# EAGLE design de1_breakout (EAGLE 6.5.0)
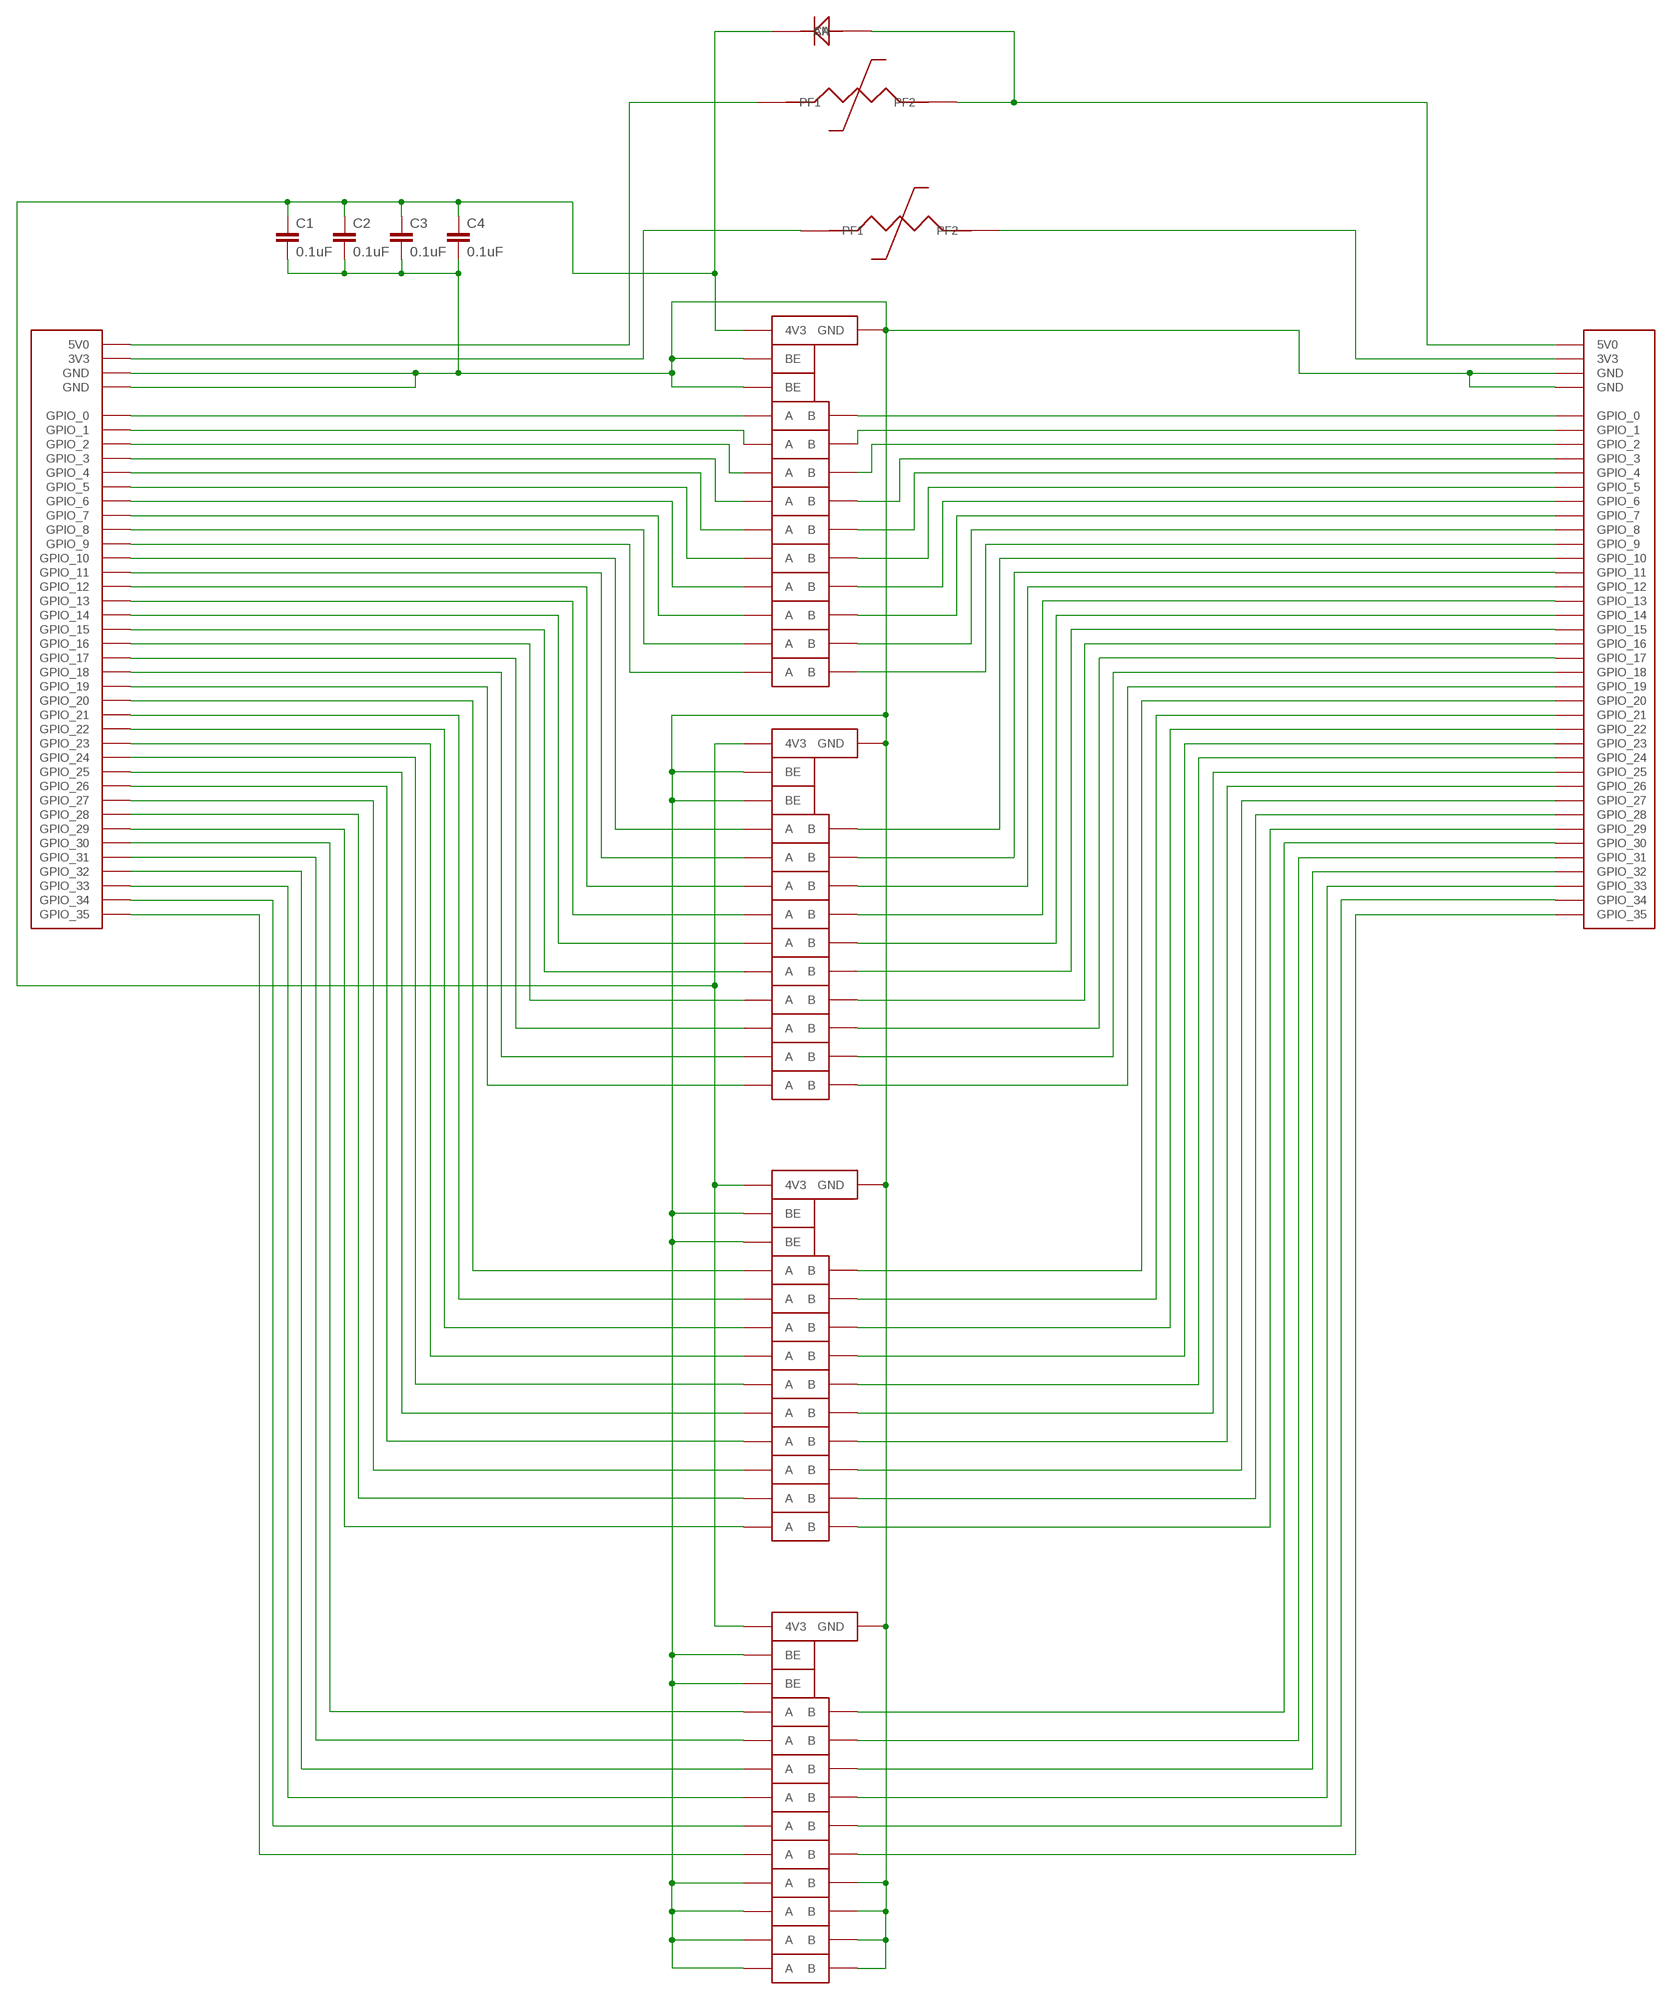
[diagram p0: schematic, sheet 1]

## Parts
1N4148  1N4148  [SOD123]
3VPOLY  POLYFUSE_1206  [C1206]
5VPOLY  POLYFUSE_1206  [C1206]
C1  0.1uF  C-EUC1206  [C1206]
C2  0.1uF  C-EUC1206  [C1206]
C3  0.1uF  C-EUC1206  [C1206]
C4  0.1uF  C-EUC1206  [C1206]
DE1_GPIO  DE1_GPIO  [DIL-100-2X20]
EXT_GPIO  DE1_GPIO_L  [DIL-100-2X20]
IC1  QS3384  [TSSOP24]
IC2  QS3384  [TSSOP24]
IC3  QS3384  [TSSOP24]
IC4  QS3384  [TSSOP24]

## Nets
3V3_IN: 3VPOLY.1(PF1) DE1_GPIO.29(3V3)
3V3_OUT: 3VPOLY.2(PF2) EXT_GPIO.29(3V3)
4V3_INT: 1N4148.1(CA) C1.1 C2.1 C3.1 C4.1 IC1.24(4V3) IC2.24(4V3) IC3.24(4V3) IC4.24(4V3)
5V0_IN: 5VPOLY.1(PF1) DE1_GPIO.11(5V0)
5V0_OUT: 1N4148.2(AN) 5VPOLY.2(PF2) EXT_GPIO.11(5V0)
GND: C1.2 C2.2 C3.2 C4.2 DE1_GPIO.12(GND) DE1_GPIO.30(GND) EXT_GPIO.12(GND) EXT_GPIO.30(GND) IC1.1(BEA:BE) IC1.12(GND) IC1.13(BEB:BE) IC2.1(BEA:BE) IC2.12(GND) IC2.13(BEB:BE) IC3.1(BEA:BE) IC3.12(GND) IC3.13(BEB:BE) IC4.1(BEA:BE) IC4.12(GND) IC4.13(BEB:BE) IC4.16(B) IC4.17(A) IC4.18(A) IC4.19(B) IC4.20(B) IC4.21(A) IC4.22(A) IC4.23(B)
N$2: DE1_GPIO.1(GPIO_0) IC1.3(A)
N$3: DE1_GPIO.2(GPIO_1) IC1.4(A)
N$4: DE1_GPIO.3(GPIO_2) IC1.7(A)
N$5: DE1_GPIO.4(GPIO_3) IC1.8(A)
N$6: DE1_GPIO.5(GPIO_4) IC1.11(A)
N$7: DE1_GPIO.6(GPIO_5) IC1.14(A)
N$8: DE1_GPIO.7(GPIO_6) IC1.17(A)
N$9: DE1_GPIO.8(GPIO_7) IC1.18(A)
N$10: DE1_GPIO.9(GPIO_8) IC1.21(A)
N$11: DE1_GPIO.10(GPIO_9) IC1.22(A)
N$12: DE1_GPIO.13(GPIO_10) IC2.3(A)
N$13: DE1_GPIO.14(GPIO_11) IC2.4(A)
N$14: DE1_GPIO.15(GPIO_12) IC2.7(A)
N$15: DE1_GPIO.16(GPIO_13) IC2.8(A)
N$16: DE1_GPIO.17(GPIO_14) IC2.11(A)
N$17: DE1_GPIO.18(GPIO_15) IC2.14(A)
N$18: DE1_GPIO.19(GPIO_16) IC2.17(A)
N$19: DE1_GPIO.20(GPIO_17) IC2.18(A)
N$20: DE1_GPIO.21(GPIO_18) IC2.21(A)
N$21: DE1_GPIO.22(GPIO_19) IC2.22(A)
N$22: DE1_GPIO.23(GPIO_20) IC3.3(A)
N$23: DE1_GPIO.24(GPIO_21) IC3.4(A)
N$24: DE1_GPIO.25(GPIO_22) IC3.7(A)
N$25: DE1_GPIO.26(GPIO_23) IC3.8(A)
N$26: DE1_GPIO.27(GPIO_24) IC3.11(A)
N$27: DE1_GPIO.28(GPIO_25) IC3.14(A)
N$28: DE1_GPIO.31(GPIO_26) IC3.17(A)
N$29: DE1_GPIO.32(GPIO_27) IC3.18(A)
N$30: DE1_GPIO.33(GPIO_28) IC3.21(A)
N$31: DE1_GPIO.34(GPIO_29) IC3.22(A)
N$32: DE1_GPIO.37(GPIO_32) IC4.7(A)
N$33: DE1_GPIO.35(GPIO_30) IC4.3(A)
N$34: DE1_GPIO.36(GPIO_31) IC4.4(A)
N$35: DE1_GPIO.38(GPIO_33) IC4.8(A)
N$36: DE1_GPIO.39(GPIO_34) IC4.11(A)
N$37: DE1_GPIO.40(GPIO_35) IC4.14(A)
N$38: EXT_GPIO.1(GPIO_0) IC1.2(B)
N$39: EXT_GPIO.2(GPIO_1) IC1.5(B)
N$40: EXT_GPIO.3(GPIO_2) IC1.6(B)
N$41: EXT_GPIO.4(GPIO_3) IC1.9(B)
N$42: EXT_GPIO.5(GPIO_4) IC1.10(B)
N$43: EXT_GPIO.6(GPIO_5) IC1.15(B)
N$44: EXT_GPIO.7(GPIO_6) IC1.16(B)
N$45: EXT_GPIO.8(GPIO_7) IC1.19(B)
N$46: EXT_GPIO.9(GPIO_8) IC1.20(B)
N$47: EXT_GPIO.10(GPIO_9) IC1.23(B)
N$48: EXT_GPIO.14(GPIO_11) IC2.5(B)
N$49: EXT_GPIO.15(GPIO_12) IC2.6(B)
N$50: EXT_GPIO.13(GPIO_10) IC2.2(B)
N$51: EXT_GPIO.16(GPIO_13) IC2.9(B)
N$52: EXT_GPIO.17(GPIO_14) IC2.10(B)
N$53: EXT_GPIO.18(GPIO_15) IC2.15(B)
N$54: EXT_GPIO.19(GPIO_16) IC2.16(B)
N$55: EXT_GPIO.20(GPIO_17) IC2.19(B)
N$56: EXT_GPIO.24(GPIO_21) IC3.5(B)
N$57: EXT_GPIO.21(GPIO_18) IC2.20(B)
N$58: EXT_GPIO.22(GPIO_19) IC2.23(B)
N$59: EXT_GPIO.23(GPIO_20) IC3.2(B)
N$60: EXT_GPIO.25(GPIO_22) IC3.6(B)
N$61: EXT_GPIO.26(GPIO_23) IC3.9(B)
N$62: EXT_GPIO.27(GPIO_24) IC3.10(B)
N$63: EXT_GPIO.28(GPIO_25) IC3.15(B)
N$64: EXT_GPIO.31(GPIO_26) IC3.16(B)
N$65: EXT_GPIO.32(GPIO_27) IC3.19(B)
N$66: EXT_GPIO.33(GPIO_28) IC3.20(B)
N$67: EXT_GPIO.34(GPIO_29) IC3.23(B)
N$68: EXT_GPIO.35(GPIO_30) IC4.2(B)
N$69: EXT_GPIO.36(GPIO_31) IC4.5(B)
N$70: EXT_GPIO.37(GPIO_32) IC4.6(B)
N$71: EXT_GPIO.38(GPIO_33) IC4.9(B)
N$72: EXT_GPIO.39(GPIO_34) IC4.10(B)
N$73: EXT_GPIO.40(GPIO_35) IC4.15(B)

## Library data of the parts
1N4148 = quickswitch:1N4148
3VPOLY 5VPOLY = quickswitch:POLYFUSE_1206
C1-C4 = rcl:C-EU: CAPACITOR, European symbol
DE1_GPIO = quickswitch:DE1_GPIO
EXT_GPIO = quickswitch:DE1_GPIO_L
IC1-IC4 = quickswitch:QS3384: IDT Quickswitch - 3.3V/5V conversion

## Board
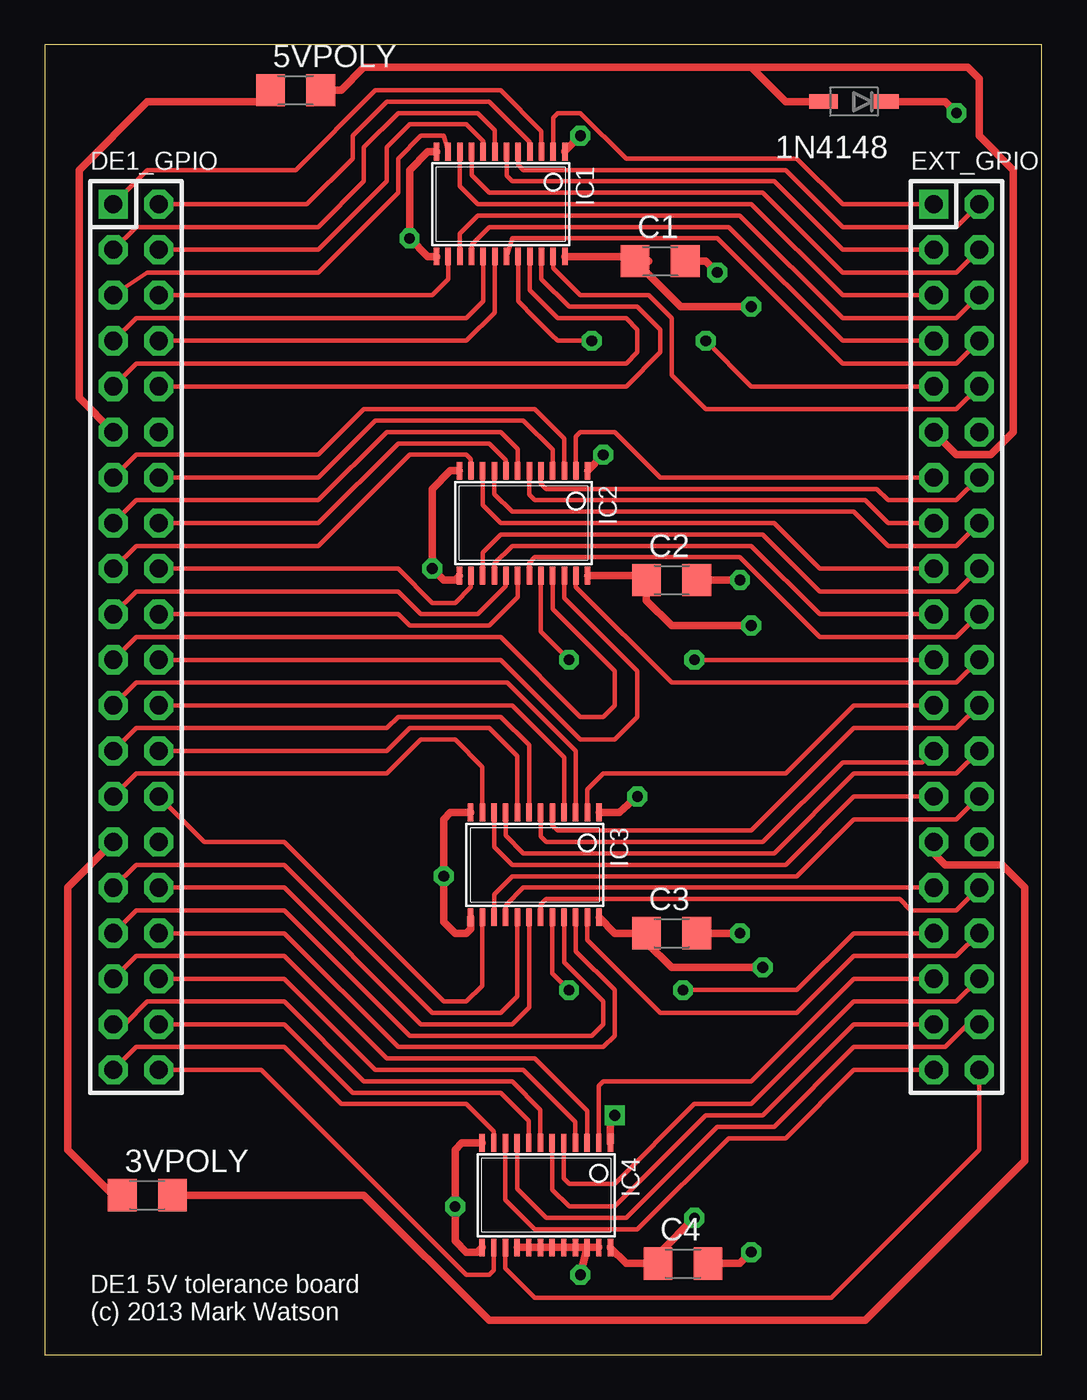
[diagram p1: board, top side]
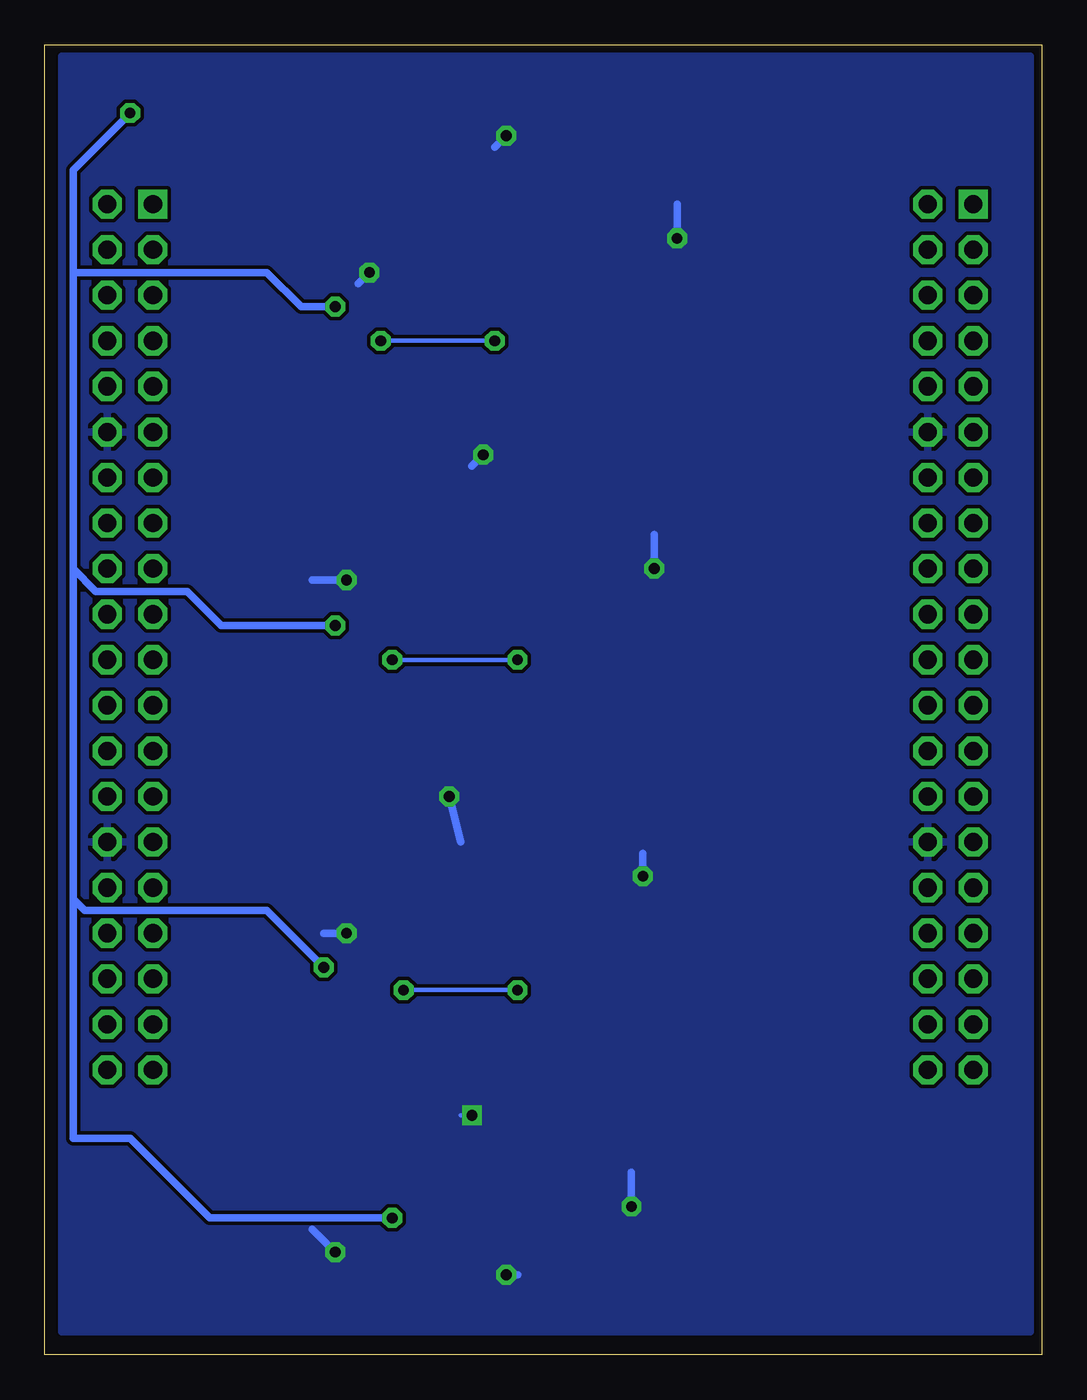
[diagram p2: board, bottom side, seen from below]

Size 55.55 x 73.02 mm. Coordinates in mm from the lower left corner, seen from the top.
Outline: 0,0 55.55,0 55.55,73.02 0,73.02 0,0
Copper layers (1*16): Top 0.035mm / dielectric 1.5mm / Bottom 0.035mm
Design rules "sparkfun": minimum track width 8mil, minimum drill 20mil, track to track 8mil, track to pad 8mil, pad to pad 8mil, via to via 8mil, smd to smd 8mil, copper to edge 10mil, drill to drill 8mil, minimum pad ring 12mil, minimum via ring 10mil, stop-mask expansion 4mil, vias tented up to drill 25mil, thermal gap 10mil

### Footprints (pad centres in the part's own frame; a part is rotated, then mirrored left to right if it is on the bottom)
SOD123 = smd 1.6 x 0.8: 1 -1.7,0; 2 1.7,0
C1206 = smd 1.6 x 1.8: 1 -1.4,0; 2 1.4,0
DIL-100-2X20 = drill 1.016 square: 1 -24.13,-1.27 | drill 1.016 octagon: 2 -24.13,1.27; 3 -21.59,-1.27; 4 -21.59,1.27; 5 -19.05,-1.27; 6 -19.05,1.27; 7 -16.51,-1.27; 8 -16.51,1.27; 9 -13.97,-1.27; 10 -13.97,1.27; 11 -11.43,-1.27; 12 -11.43,1.27; 13 -8.89,-1.27; 14 -8.89,1.27; 15 -6.35,-1.27; 16 -6.35,1.27; 17 -3.81,-1.27; 18 -3.81,1.27; 19 -1.27,-1.27; 20 -1.27,1.27; 21 1.27,-1.27; 22 1.27,1.27; 23 3.81,-1.27; 24 3.81,1.27; 25 6.35,-1.27; 26 6.35,1.27; 27 8.89,-1.27; 28 8.89,1.27; 29 11.43,-1.27; 30 11.43,1.27; 31 13.97,-1.27; 32 13.97,1.27; 33 16.51,-1.27; 34 16.51,1.27; 35 19.05,-1.27; 36 19.05,1.27; 37 21.59,-1.27; 38 21.59,1.27; 39 24.13,-1.27; 40 24.13,1.27
TSSOP24 = smd 0.305 x 0.991: 1 -3.575,-2.918; 2 -2.925,-2.918; 3 -2.275,-2.918; 4 -1.625,-2.918; 5 -0.975,-2.918; 6 -0.325,-2.918; 7 0.325,-2.918; 8 0.975,-2.918; 9 1.625,-2.918; 10 2.275,-2.918; 11 2.925,-2.918; 12 3.575,-2.918; 13 3.575,2.918; 14 2.925,2.918; 15 2.275,2.918; 16 1.625,2.918; 17 0.975,2.918; 18 0.325,2.918; 19 -0.325,2.918; 20 -0.975,2.918; 21 -1.625,2.918; 22 -2.275,2.918; 23 -2.925,2.918; 24 -3.575,2.918

### Placement (x,y rotation side)
1N4148  45.08,69.85 180 top
3VPOLY  5.71,8.89 0 top
5VPOLY  13.97,70.48 0 top
C1  34.29,60.96 0 top
C2  34.92,43.18 0 top
C3  34.92,23.49 0 top
C4  35.56,5.08 0 top
DE1_GPIO  5.08,40 270 top
EXT_GPIO  50.8,40 270 top
IC1  25.4,64.14 180 top
IC2  26.67,46.35 180 top
IC3  27.3,27.3 180 top
IC4  27.94,8.89 180 top

### Tracks (layer width: path | path; a pad name or v marks a point on that pad's centre or on a via)
3V3_IN
  Top 0.406: DE1_GPIO.29 1.27,26.03 1.27,11.43 3.81,8.89 3VPOLY.1
3V3_OUT
  Top 0.406: EXT_GPIO.29 49.53,27.94 50.16,27.3 53.34,27.3 54.61,26.03 54.61,10.79 45.72,1.9 24.77,1.9 17.78,8.89 3VPOLY.2
4V3_INT  (via drill 0.6)
  Top 0.406: IC2.24 33.27,43.44 C2.1 33.52,42.04 34.92,40.64 v39.37,40.64 | C1.1 33.65,60.96 | v39.37,58.42 35.43,58.42 C1.1 | v50.8,69.22 50.16,69.85 1N4148.1 | IC1.24 32.63,61.22 C1.1 | IC3.24 30.88,24.36 31.75,23.49 C3.1 33.52,22.99 34.92,21.59 v40,21.59 | IC4.24 31.51,5.95 32.38,5.08 C4.1 34.29,5.08 34.29,5.72 v36.2,7.62
  Bottom 0.406: v39.37,58.42 41.27,58.42 43.18,60.33 53.97,60.33 | 53.97,60.33 53.97,66.04 v50.8,69.22 | 53.97,43.81 52.7,42.55 47.62,42.55 45.72,40.64 v39.37,40.64 | 53.97,43.81 53.97,60.33 | v40,21.59 43.18,24.77 53.34,24.77 53.97,25.4 | 53.97,25.4 53.97,43.81 | v36.2,7.62 46.35,7.62 50.8,12.06 53.97,12.06 53.97,25.4
5V0_IN
  Top 0.406: DE1_GPIO.11 1.9,53.34 1.9,66.04 5.71,69.85 11.94,69.85 5VPOLY.1
5V0_OUT
  Top 0.406: 39.37,71.75 51.43,71.75 52.07,71.12 52.07,67.94 53.97,66.04 53.97,51.43 52.7,50.16 50.8,50.16 EXT_GPIO.11 | 39.37,71.75 17.78,71.75 16.51,70.48 5VPOLY.2 | 1N4148.2 41.27,69.85 39.37,71.75
GND  (via drill 0.6)
  Top 0.406: IC4.1 31.51,13.1 v31.75,13.33 | IC3.1 32.01,30.22 v33.02,31.11 | IC4.16 IC4.17 IC4.18 IC4.19 IC4.20 IC4.21 IC4.22 | IC4.22 IC4.23 | IC4.22 v29.84,4.45 | C3.2 v38.73,23.49 | C4.2 38.73,5.08 v39.37,5.72 | IC3.13 23.73,23.73 23.5,23.49 22.86,23.49 22.23,24.13 v22.23,26.67 22.23,29.84 22.6,30.22 IC3.12 | IC2.13 23.09,43.41 22.86,43.18 22.23,43.18 v21.59,43.81 21.59,48.26 22.6,49.27 IC2.12 | C2.2 v38.73,43.18 | IC2.1 30.25,49.3 v31.11,50.16 | IC1.13 21.33,61.22 v20.32,62.23 20.32,66.04 21.33,67.05 IC1.12 | IC1.1 28.98,67.08 v29.84,67.94 | C1.2 36.83,60.96 v37.46,60.33 | IC4.12 23.24,11.81 22.86,11.43 v22.86,8.26 22.86,6.35 23.5,5.72 24.11,5.72 IC4.13
  Bottom 0.254: v31.75,13.33 32.38,13.33
  Bottom 0.406: v33.02,31.11 32.38,28.57 | v29.84,4.45 29.21,4.45 | v38.73,23.49 40,23.49 | v39.37,5.72 40.64,6.99 | v22.23,26.67 22.23,27.94 | v21.59,43.81 21.59,45.72 | v38.73,43.18 40.64,43.18 | v31.11,50.16 31.75,49.53 | v20.32,62.23 20.32,64.14 | v29.84,67.94 30.48,67.31 | v37.46,60.33 38.1,59.69 | v22.86,8.26 22.86,10.16
  pour Bottom: 0.64,72.39 54.61,72.39 54.61,1.27 0.64,1.27
N$2
  Top 0.254: DE1_GPIO.1 5.71,66.04 13.97,66.04 18.41,70.48 25.4,70.48 27.68,68.21 IC1.3
N$3
  Top 0.254: DE1_GPIO.2 14.61,64.14 17.14,66.67 17.14,67.94 19.05,69.85 24.77,69.85 27.03,67.59 IC1.4
N$4
  Top 0.254: DE1_GPIO.3 5.08,62.86 15.24,62.86 17.78,65.41 17.78,67.31 19.68,69.22 24.13,69.22 25.07,68.27 IC1.7
N$5
  Top 0.254: DE1_GPIO.4 15.24,61.59 19.05,65.41 19.05,67.31 20.32,68.58 23.5,68.58 24.43,67.65 IC1.8
N$6
  Top 0.254: DE1_GPIO.5 5.71,60.33 15.24,60.33 19.68,64.77 19.68,66.67 20.96,67.94 22.23,67.94 IC1.11
N$7
  Top 0.254: DE1_GPIO.6 21.59,59.05 22.48,59.94 IC1.14
N$8
  Top 0.254: DE1_GPIO.7 5.08,57.78 23.5,57.78 24.43,58.72 IC1.17
N$9
  Top 0.254: DE1_GPIO.8 23.5,56.52 25.07,58.09 IC1.18
N$10
  Top 0.254: DE1_GPIO.9 5.08,55.25 32.38,55.25 33.02,55.88 33.02,57.15 32.38,57.78 28.57,57.78 27.03,59.33 IC1.21
N$11
  Top 0.254: DE1_GPIO.10 32.38,53.97 34.29,55.88 34.29,57.15 33.02,58.42 29.21,58.42 27.68,59.95 IC1.22
N$12
  Top 0.254: DE1_GPIO.13 5.08,50.16 15.24,50.16 17.78,52.7 27.3,52.7 28.95,51.06 IC2.3
N$13
  Top 0.254: DE1_GPIO.14 15.24,48.89 18.41,52.07 26.67,52.07 28.3,50.45 IC2.4
N$14
  Top 0.254: DE1_GPIO.15 5.08,47.62 15.24,47.62 19.05,51.43 25.4,51.43 26.34,50.49 IC2.7
N$15
  Top 0.254: DE1_GPIO.16 15.24,46.35 19.68,50.8 24.77,50.8 25.7,49.87 IC2.8
N$16
  Top 0.254: DE1_GPIO.17 5.08,45.09 15.24,45.09 20.32,50.16 23.5,50.16 23.75,49.91 IC2.11
N$17
  Top 0.254: DE1_GPIO.18 19.68,43.81 21.59,41.91 22.86,41.91 23.75,42.8 IC2.14
N$18
  Top 0.254: DE1_GPIO.19 5.08,42.55 19.68,42.55 20.96,41.27 24.13,41.27 25.7,42.84 IC2.17
N$19
  Top 0.254: DE1_GPIO.20 19.68,41.27 20.32,40.64 24.77,40.64 26.34,42.22 IC2.18
N$20
  Top 0.254: DE1_GPIO.21 5.08,40 25.4,40 29.84,35.56 31.11,35.56 31.75,36.2 31.75,38.1 28.3,41.55 IC2.21
N$21
  Top 0.254: DE1_GPIO.22 25.4,38.73 29.84,34.29 31.75,34.29 33.02,35.56 33.02,38.1 28.95,42.17 IC2.22
N$22
  Top 0.254: DE1_GPIO.23 5.08,37.46 25.77,37.46 29.58,33.66 IC3.3
N$23
  Top 0.254: DE1_GPIO.24 26.04,36.2 28.93,33.3 IC3.4
N$24
  Top 0.254: DE1_GPIO.25 5.08,34.92 19.05,34.92 19.68,35.56 25.4,35.56 26.98,33.98 IC3.7
N$25
  Top 0.254: DE1_GPIO.26 19.05,33.66 20.32,34.92 24.77,34.92 26.33,33.36 IC3.8
N$26
  Top 0.254: DE1_GPIO.27 5.08,32.38 19.05,32.38 20.96,34.29 22.86,34.29 24.38,32.77 IC3.11
N$27
  Top 0.254: DE1_GPIO.28 8.89,28.57 13.34,28.57 22.23,19.69 23.5,19.69 24.38,20.57 IC3.14
N$28
  Top 0.254: DE1_GPIO.31 5.08,27.3 13.34,27.3 21.59,19.05 25.4,19.05 26.33,19.98 IC3.17
N$29
  Top 0.254: DE1_GPIO.32 13.34,26.03 20.96,18.41 26.04,18.41 26.98,19.36 IC3.18
N$30
  Top 0.254: DE1_GPIO.33 5.08,24.77 13.34,24.77 20.32,17.78 30.48,17.78 31.11,18.41 31.11,19.69 28.93,21.87 IC3.21
N$31
  Top 0.254: DE1_GPIO.34 13.34,23.49 19.68,17.15 31.11,17.15 31.75,17.78 31.75,20.32 29.58,22.49 IC3.22
N$32
  Top 0.254: DE1_GPIO.37 4.45,18.41 5.71,19.69 13.34,19.69 17.78,15.24 26.04,15.24 27.62,13.66 IC4.7
N$33
  Top 0.254: DE1_GPIO.35 5.08,22.23 13.34,22.23 19.05,16.51 27.3,16.51 30.21,13.6 IC4.3
N$34
  Top 0.254: IC4.4 29.57,12.98 26.67,15.88 18.41,15.88 13.34,20.95 DE1_GPIO.36
N$35
  Top 0.254: IC4.8 26.96,13.04 25.4,14.6 17.14,14.6 13.34,18.41 DE1_GPIO.38
N$36
  Top 0.254: DE1_GPIO.39 5.08,17.15 13.34,17.15 16.51,13.97 23.5,13.97 25.02,12.45 IC4.11
N$37
  Top 0.254: IC4.14 25.02,4.7 24.77,4.45 23.5,4.45 12.07,15.88 DE1_GPIO.40
N$38
  Top 0.254: EXT_GPIO.1 45.72,64.14 45.08,64.14 44.45,64.14 41.91,66.67 32.38,66.67 29.84,69.22 28.57,69.22 28.32,68.97 IC1.2
N$39
  Top 0.254: EXT_GPIO.2 50.8,62.86 44.45,62.86 41.27,66.04 27.94,66.04 27.3,66.04 26.67,66.04 26.38,66.33 IC1.5
N$40
  Top 0.254: EXT_GPIO.3 44.45,61.59 40.64,65.41 26.04,65.41 25.73,65.72 IC1.6
N$41
  Top 0.254: EXT_GPIO.4 50.8,60.33 44.45,60.33 40,64.77 24.77,64.77 23.78,65.76 IC1.9
N$42
  Top 0.254: EXT_GPIO.5 44.45,59.05 39.37,64.14 24.13,64.14 23.81,64.45 23.5,64.77 23.12,65.14 IC1.10
N$43
  Top 0.254: EXT_GPIO.6 50.8,57.78 44.45,57.78 38.73,63.5 24.13,63.5 23.12,62.5 IC1.15
N$44
  Top 0.254: IC1.16 23.78,61.88 24.77,62.86 38.1,62.86 44.45,56.52 EXT_GPIO.7
N$45
  Top 0.254: EXT_GPIO.8 50.8,55.25 44.45,55.25 37.46,62.23 26.04,62.23 IC1.19
N$46  (via drill 0.6)
  Top 0.254: EXT_GPIO.9 39.37,53.97 v36.83,56.52 | v30.48,56.52 28.57,56.52 28.26,56.83 27.3,57.78 26.38,58.72 IC1.20
  Bottom 0.254: v36.83,56.52 v30.48,56.52
N$47
  Top 0.254: EXT_GPIO.10 50.8,52.7 36.83,52.7 34.92,54.61 34.92,57.78 33.65,59.05 29.84,59.05 28.32,60.58 IC1.23
N$48
  Top 0.254: EXT_GPIO.14 50.8,47.62 46.99,47.62 46.35,48.26 27.94,48.26 27.64,48.55 IC2.5
N$49
  Top 0.254: EXT_GPIO.15 46.99,46.35 45.72,47.62 27.3,47.62 27,47.93 IC2.6
N$50
  Top 0.254: EXT_GPIO.13 34.29,48.89 31.75,51.43 29.84,51.43 29.59,51.18 IC2.2
N$51
  Top 0.254: EXT_GPIO.16 50.8,45.09 46.99,45.09 45.08,46.99 26.04,46.99 25.05,47.98 IC2.9
N$52
  Top 0.254: EXT_GPIO.17 43.18,43.81 40.64,46.35 25.4,46.35 24.39,47.36 IC2.10
N$53
  Top 0.254: EXT_GPIO.18 50.8,42.55 43.18,42.55 40,45.72 25.4,45.72 24.39,44.71 IC2.15
N$54
  Top 0.254: IC2.16 25.05,44.09 26.04,45.09 39.37,45.09 43.18,41.27 EXT_GPIO.19
N$55
  Top 0.254: EXT_GPIO.20 50.8,40 43.18,40 38.73,44.45 27.3,44.45 27,44.14 IC2.19
N$56
  Top 0.254: IC3.5 28.28,29.5 28.57,29.21 39.37,29.21 45.08,34.92 50.8,34.92 EXT_GPIO.24
N$57  (via drill 0.6)
  Top 0.254: EXT_GPIO.21 v36.2,38.73 | v29.21,38.73 28.57,39.37 27.94,40 27.64,40.3 IC2.20
  Bottom 0.254: v36.2,38.73 v29.21,38.73
N$58
  Top 0.254: EXT_GPIO.22 50.8,37.46 34.92,37.46 29.59,42.8 IC2.23
N$59
  Top 0.254: IC3.2 30.23,31.5 31.11,32.38 41.27,32.38 45.08,36.2 EXT_GPIO.23
N$60
  Top 0.254: IC3.6 27.63,28.88 27.94,28.57 40,28.57 44.45,33.02 48.89,33.02 EXT_GPIO.25
N$61
  Top 0.254: EXT_GPIO.26 50.8,32.38 45.08,32.38 40.64,27.94 26.67,27.94 25.68,28.93 IC3.9
N$62
  Top 0.254: EXT_GPIO.27 45.08,31.11 41.27,27.3 26.04,27.3 25.03,28.31 IC3.10
N$63
  Top 0.254: IC3.15 25.03,25.66 26.04,26.67 41.91,26.67 45.08,29.84 50.8,29.84 EXT_GPIO.28
N$64
  Top 0.254: IC3.16 25.68,25.05 26.67,26.03 EXT_GPIO.31
N$65
  Top 0.254: IC3.19 27.63,25.09 27.94,25.4 47.62,25.4 48.26,24.77 50.8,24.77 EXT_GPIO.32
N$66  (via drill 0.6)
  Top 0.254: EXT_GPIO.33 45.08,23.49 41.91,20.32 v35.56,20.32 | 28.57,20.95 v29.21,20.32 28.28,21.25 IC3.20
  Bottom 0.254: v35.56,20.32 v29.21,20.32
N$67
  Top 0.254: EXT_GPIO.34 50.8,22.23 45.08,22.23 41.91,19.05 34.29,19.05 30.23,23.11 IC3.23
N$68
  Top 0.254: EXT_GPIO.35 45.08,20.95 39.37,15.24 31.11,15.24 30.86,14.99 IC4.2
N$69
  Top 0.254: EXT_GPIO.36 50.8,19.69 45.08,19.69 39.37,13.97 36.2,13.97 31.75,9.53 29.21,9.53 28.91,9.82 IC4.5
N$70
  Top 0.254: EXT_GPIO.37 45.08,18.41 40,13.33 36.83,13.33 31.75,8.26 29.21,8.26 28.27,9.2 IC4.6
N$71
  Top 0.254: EXT_GPIO.38 51.43,18.41 50.16,17.15 45.08,17.15 40.64,12.7 37.46,12.7 32.38,7.62 27.94,7.62 26.32,9.24 IC4.9
N$72
  Top 0.254: EXT_GPIO.39 45.08,15.88 41.27,12.06 38.1,12.06 33.02,6.99 27.3,6.99 25.66,8.63 IC4.10
N$73
  Top 0.254: EXT_GPIO.40 52.07,11.43 43.81,3.18 27.3,3.18 25.66,4.81 IC4.15

### Text on the board
tNames: DE1 5V tolerance board / (c) 2013 Mark Watson